# Altium schematic sheet 08-DEV_POWER.SchDoc: USB3.0 AMOLED Touchscreen power
size A3; DrawnBy: Rain Adelbert; Revision: 1.2; SheetNumber: 8; SheetTotal: 9
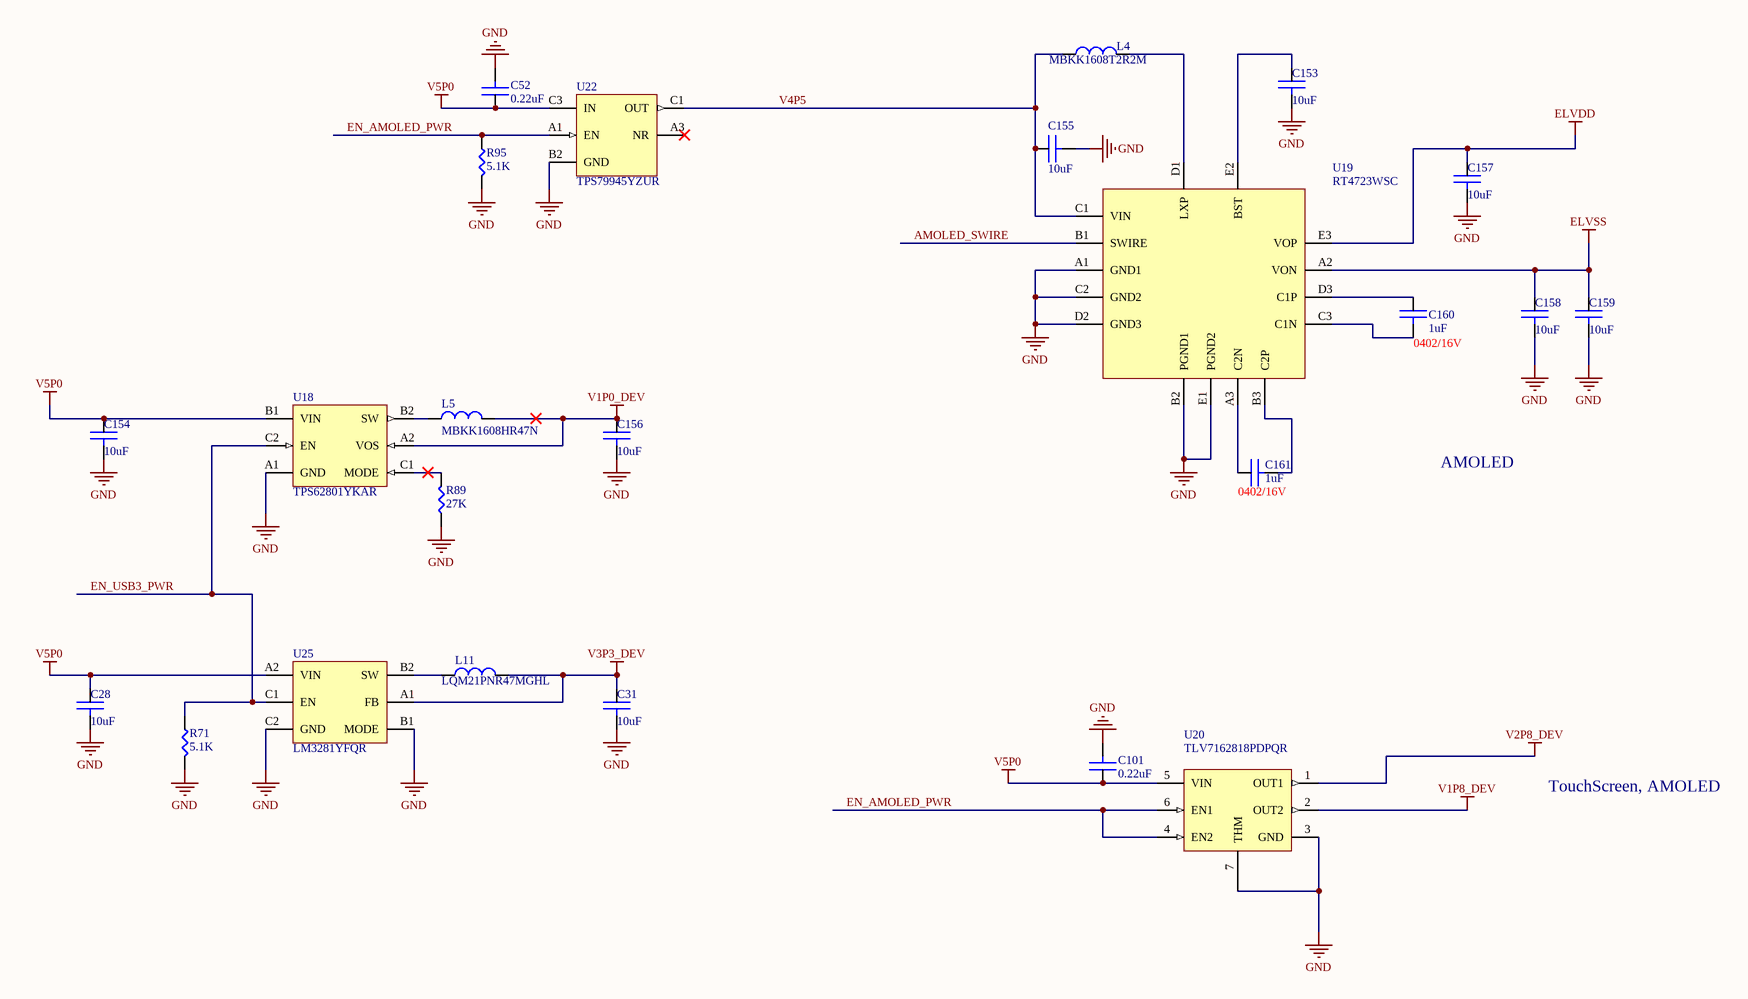
[diagram p0: 08-DEV_POWER.SchDoc]

## Parts
C28  10uF  [C0402]
C31  10uF  [C0402]
C52  0.22uF  [C0201]
C101  0.22uF  [C0201]
C153  10uF  [C0402]
C154  10uF  [C0402]
C155  10uF  [C0402]
C156  10uF  [C0402]
C157  10uF  [C0402]
C158  10uF  [C0402]
C159  10uF  [C0402]
C160  1uF  [C0402]
C161  1uF  [C0402]
L4  MBKK1608T2R2M  [L0603]
L5  MBKK1608HR47N  [L0603]
L11  LQM21PNR47MGHL  [L0805]
R71  5.1K  [R0201]
R89  27K  [R0201]
R95  5.1K  [R0201]
U18  TPS62801YKAR  [DSBGA6]
U19  RT4723WSC  [WLCSP-15B]
U20  TLV7162818PDPQR  [X2SON-6]
U22  TPS79945YZUR  [DSBGA5]
U25  LM3281YFQR  [DSBGA6]

## Nets
ELVDD: C157.1 U19.E3(VOP)
ELVSS: C158.1 C159.1 U19.A2(VON)
GND: C28.2 C31.2 C52.2 C101.2 C153.2 C154.2 C155.2 C156.2 C157.2 C158.2 C159.2 R71.2 R89.1 R95.2 U18.A1(GND) U19.A1(GND1) U19.B2(PGND1) U19.C2(GND2) U19.D2(GND3) U19.E1(PGND2) U20.3(GND) U20.7(THM) U22.B2(GND) U25.B1(MODE) U25.C2(GND)
V1P0_DEV: C156.1 L5.2 U18.A2(VOS)
V1P8_DEV: U20.2(OUT2)
V2P8_DEV: U20.1(OUT1)
V3P3_DEV: C31.1 L11.2 U25.A1(FB)
V5P0: C28.1 C52.1 C101.1 C154.1 U18.B1(VIN) U20.5(VIN) U22.C3(IN) U25.A2(VIN)
AMOLED_SWIRE: U19.B1(SWIRE)
EN_AMOLED_PWR: R95.1 U20.4(EN2) U20.6(EN1) U22.A1(EN)
EN_USB3_PWR: R71.1 U18.C2(EN) U25.C1(EN)
V4P5: C155.1 L4.1 U19.C1(VIN) U22.C1(OUT)
NetC153_1: C153.1 U19.E2(BST)
NetC160_1: C160.1 U19.D3(C1P)
NetC160_2: C160.2 U19.C3(C1N)
NetC161_1: C161.1 U19.A3(C2N)
NetC161_2: C161.2 U19.B3(C2P)
NetL4_2: L4.2 U19.D1(LXP)
NetL5_1: L5.1 U18.B2(SW)
NetL11_1: L11.1 U25.B2(SW)
NetR89_2: R89.2 U18.C1(MODE)

Not connected (* = marked no-connect by the designer): U22 A3(NR)*

## Notes on the sheet
- (near C160) 0402/16V
- (near C161) 0402/16V
- AMOLED
- TouchScreen, AMOLED
- Title
- Size:
- Date:
- A3
- https://asicvault.io
- Time:
- Revision:
- Sheet
- of
- 2.0.6
- Copyright © 2016-2021 AsicVault Ltd.
- Tornimäe 5, 2nd floor, Tallinn 10145, Estonia
- Authors: Hando Eilsen, Rain Adelbert, Robbie B.H.
- License: Apache 2.0 with Commons Clause
- Please read LICENSE.md
- File:

## Library data of the parts
C28 C31 C153-C159 = 10uF/0402: Description 1: Multilayer Ceramic Capacitors MLCC - SMD/SMT 10uF 20% 6.3 Volts 0402; Supplier Part Number 1: 791-0402X106M6R3CT; Supplier 1: Mouser
C52 C101 = 0.22uF/0201: Description 1: CAP CER 0.22UF 6.3V X7S 0201; Supplier 1: Digi-Key; Supplier Part Number 1: 445-9075-1-ND
C160 C161 = 1uF/0402/16V: Description 1: CAP CER 1UF 16V X5R 0402; Supplier 1: Digi-Key; Supplier Part Number 1: 311-1691-1-ND
L4 = 2.2uH/MBKK1608T2R2M: Description 1: FIXED IND 2.2UH 750MA 345 MOHM; Supplier 1: Digi-Key; Supplier Part Number 1: 587-4150-1-ND
L5 = 0.47uH/MBKK1608HR47N: Description 1: 0.47uH, 104mohm, 1.1A. 0805; Supplier 1: Mouser; Supplier Part Number 1: 963-MBKK1608HR47N
L11 = 0.47uH/LQM21PNR47MGHL: Description 1: 0.47uH, 40mohm, 2.4A. 0805; Supplier 1: Mouser; Supplier Part Number 1: 81-LQM21PNR47MGHL
R71 R95 = 5.1K/1%/0201: Description 1: RES SMD 5.1K OHM 1% 1/20W 0201; Supplier 1: Digi-Key; Supplier Part Number 1: YAG2741CT-ND
R89 = 27K/1%/0201: Description 1: RES SMD 27K OHM 1% 1/20W 0201; Supplier 1: Digi-Key; Supplier Part Number 1: P27.0KABCT-ND
U18 = TPS62801YKAR: IC REG BCK 0.85-1.5V 1.0A; Supplier 1: Mouser; Supplier Part Number 1: 595-TPS62801YKAR; Description 1: IC REG BCK 0.85-1.5V 1.0A
U19 = RT4723WSC: Description 1: Converter, AMOLED Display Voltage Regulator IC 2 Output 15-WLCSP (2.07x1.39); Supplier Part Number 1: RT4723WSCTR-ND; Supplier 1: Digikey
U20 = TLV7162818PDPQR: Dual LDO 1.8V, 2.8V X2SON-6; Description 1: Dual LDO 1.8V 2.8V; Supplier 1: Mouser; Supplier Part Number 1: 595-TLV7162818PDPQR
U22 = TPS79945YZUR: LDO 200mA DSBGA; Description 1: LDO Voltage Regulators 200mA Fixed(4.5V); Supplier 1: Mouser; Supplier Part Number 1: 595-TPS79945YZUR
U25 = LM3281YFQR: Description 1: IC REG BCK 3.3V 1.2A SYNC 6DSBGA; Supplier 1: Digi-Key; Supplier Part Number 1: 296-40185-6-ND